# Altium schematic sheet WIFI & bluetooth.SchDoc
size A4; SheetNumber: 3; SheetTotal: 5
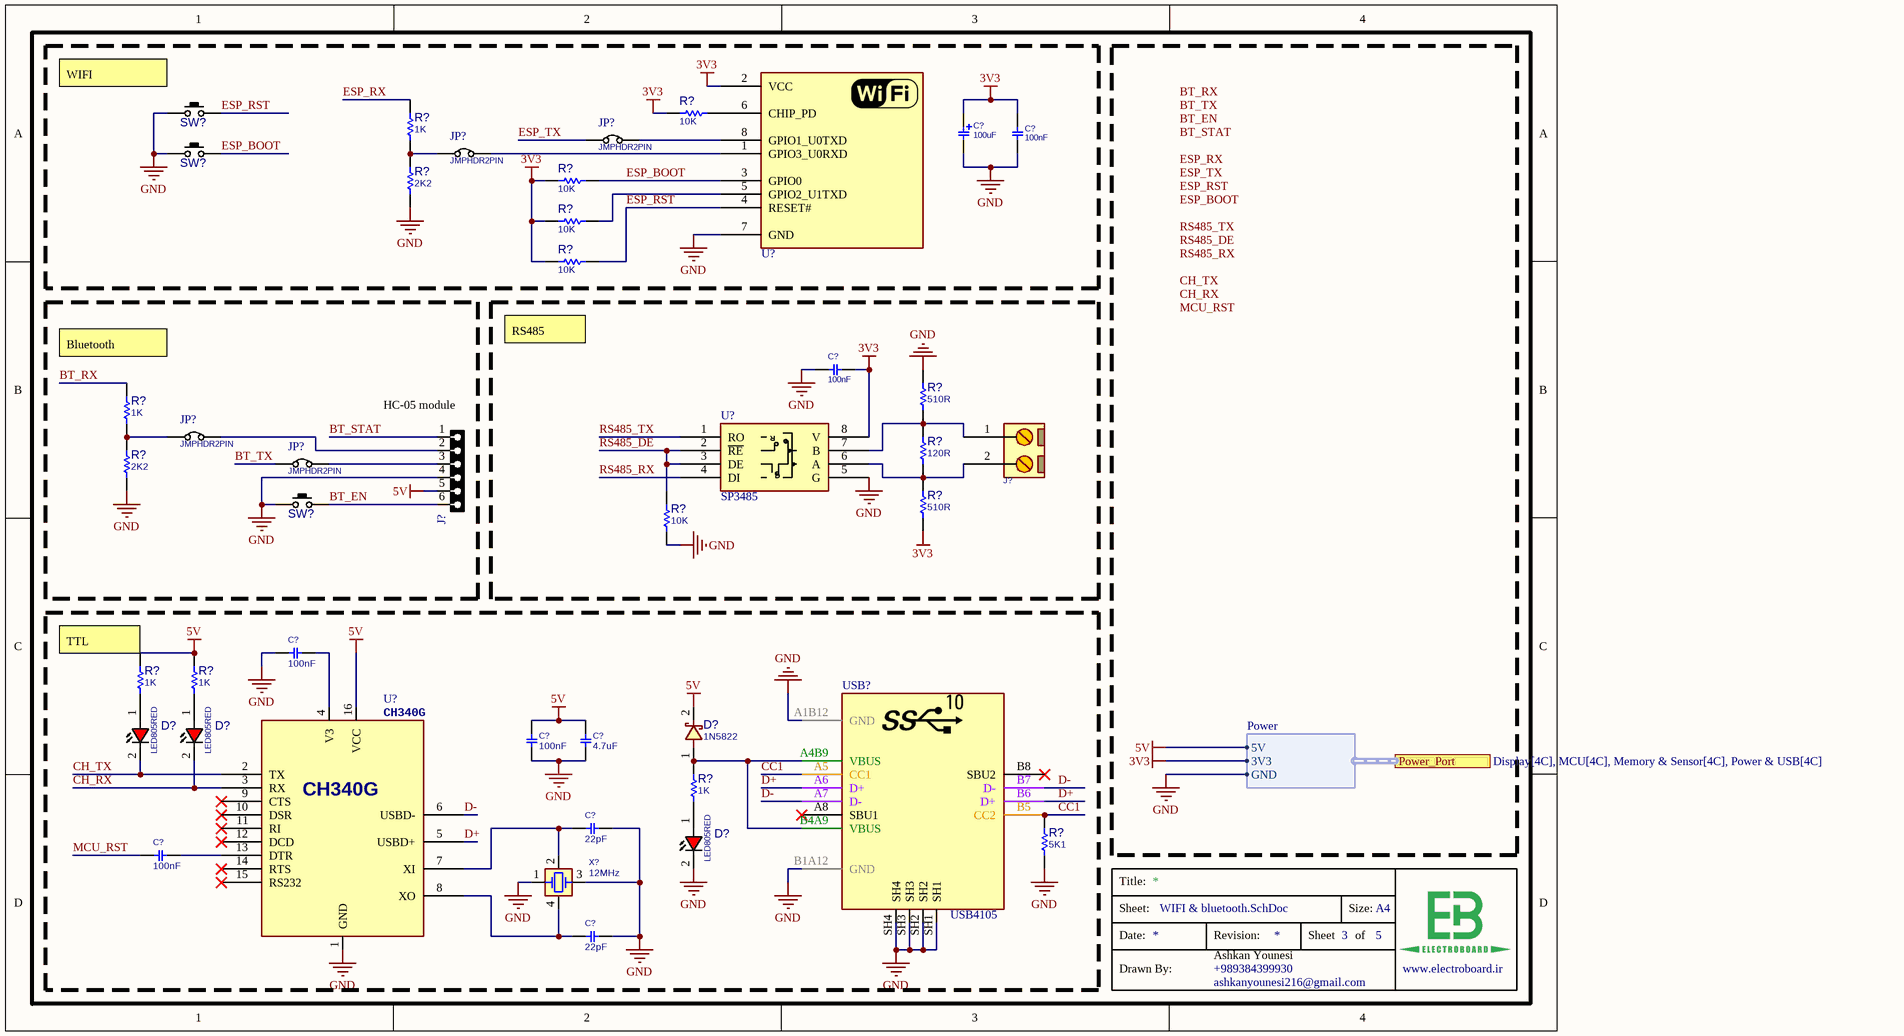
[diagram p0: WIFI & bluetooth.SchDoc]

## Parts
(Parts that share a designator on the sheet are numbered #1, #2 ... from top to bottom, then left to right.)
C?#1  100uF  [C_TN_3216]
C?#2  100nF  [C0603]
C?#3  100nF  [C0805]
C?#4  100nF  [C0805]
C?#5  100nF  [C0805]
C?#6  4.7uF  [C0805]
C?#7  22pF  [C0805]
C?#8  100nF  [C0805]
C?#9  22pF  [C0805]
D?#1  LED805RED  [LED0805RED]
D?#2  LED805RED  [LED0805RED]
D?#3  1N5822  [D_SMA]
D?#4  LED805RED  [LED0805RED]
J?#1  CONN_TB2  [MSTB_2]  (value not drawn)
J?#2  HDRF6  [HDR_F_1X6]  (value not drawn)
JP?#1  JMPHDR2PIN  [JP_2_BLK]
JP?#2  JMPHDR2PIN  [JP_2_BLK]
JP?#3  JMPHDR2PIN  [JP_2_BLK]
JP?#4  JMPHDR2PIN  [JP_2_BLK]
R?#1  10K  [R0805]
R?#2  1K  [R0805]
R?#3  2K2  [R0805]
R?#4  10K  [R0805]
R?#5  10K  [R0805]
R?#6  10K  [R0805]
R?#7  510R  [R0805]
R?#8  1K  [R0805]
R?#9  120R  [R0805]
R?#10  2K2  [R0805]
R?#11  510R  [R0805]
R?#12  10K  [R0805]
R?#13  1K  [R0805]
R?#14  1K  [R0805]
R?#15  1K  [R0805]
R?#16  5K1  [R0805]
SW?#1  PUSHBUTTON  [SWPBS_SPST_6X3X5]  (value not drawn)
SW?#2  PUSHBUTTON  [SWPBS_SPST_6X3X5]  (value not drawn)
SW?#3  PUSHBUTTON  [SWPBS_SPST_6X3X5]  (value not drawn)
U?#1  ESP-01  [ESP8266_ESP01]  (value not drawn)
U?#2  SP3485  [SO_8]
U?#3  CH340G  [SO_16]
USB?  USB4105  [USBC_SMD_16_USB4105]
X?  12MHz  [XTL_4_3225]

## Ports
Power_Port (harness POWER, see Display[4C], MCU[4C], Memory & Sensor[4C], Power & USB[4C])

## Harnesses
Power: 5V, 3V3, GND

## Nets
3V3: C?#1.1 C?#2.2 C?#3.1 R?#1.1 R?#4.1 R?#5.1 R?#6.1 R?#11.2 U?#1.2(VCC) U?#2.8(V) ; port Power_Port.3V3
5V: C?#5.2 C?#6.2 D?#3.2 J?#2.5 R?#13.1 R?#14.1 U?#3.16(VCC) ; port Power_Port.5V
GND: C?#1.2 C?#2.1 C?#3.2 C?#4.2 C?#5.1 C?#6.1 C?#7.1 C?#9.1 D?#4.2(CATHODE) J?#2.4 R?#3.2 R?#7.1 R?#10.2 R?#12.2 R?#16.2 SW?#1.1(P1) SW?#2.1(P1) SW?#3.1(P1) U?#1.7(GND) U?#2.5(G) U?#3.1(GND) USB?.A1B12(GND) USB?.B1A12(GND) USB?.SH1 USB?.SH2 USB?.SH3 USB?.SH4 X?.1 X?.3 ; port Power_Port.GND
BT_EN: J?#2.6 SW?#3.2(P3)
BT_RX: R?#8.1
BT_STAT: J?#2.1
BT_TX: JP?#4.1
CC1: R?#16.1 USB?.A5(CC1) USB?.B5(CC2)
CH_RX: D?#2.2(CATHODE) U?#3.3(RX)
CH_TX: D?#1.2(CATHODE) U?#3.2(TX)
D+: U?#3.5(USBD+) USB?.A6(D+) USB?.B6(D+)
D-: U?#3.6(USBD-) USB?.A7(D-) USB?.B7(D-)
ESP_BOOT: R?#4.2 SW?#2.2(P3) U?#1.3(GPIO0)
ESP_RST: R?#6.2 SW?#1.2(P3) U?#1.4(RESET#)
ESP_RX: R?#2.1
ESP_TX: JP?#1.1
MCU_RST: C?#8.2
RS485_DE: R?#12.1 U?#2.2(~{RE}) U?#2.3(DE)
RS485_RX: U?#2.4(DI)
RS485_TX: U?#2.1(RO)
NetC?#4_1: C?#4.1 U?#3.4(V3)
NetC?#7_2: C?#7.2 U?#3.7(XI) X?.2
NetC?#8_1: C?#8.1 U?#3.13(DTR)
NetC?#9_2: C?#9.2 U?#3.8(XO) X?.4
NetD?#1_1: D?#1.1(ANODE) R?#13.2
NetD?#2_1: D?#2.1(ANODE) R?#14.2
NetD?#3_1: D?#3.1 R?#15.1 USB?.A4B9(VBUS) USB?.B4A9(VBUS)
NetD?#4_1: D?#4.1(ANODE) R?#15.2
NetJ?#1_1: J?#1.1 R?#7.2 R?#9.1 U?#2.7(B)
NetJ?#1_2: J?#1.2 R?#9.2 R?#11.1 U?#2.6(A)
NetJ?#2_2: J?#2.2 JP?#3.2
NetJ?#2_3: J?#2.3 JP?#4.2
NetJP?#1_2: JP?#1.2 U?#1.8(GPIO1_U0TXD)
NetJP?#2_1: JP?#2.1 R?#2.2 R?#3.1
NetJP?#2_2: JP?#2.2 U?#1.1(GPIO3_U0RXD)
NetJP?#3_1: JP?#3.1 R?#8.2 R?#10.1
NetR?#1_2: R?#1.2 U?#1.6(CHIP_PD)
NetR?#5_2: R?#5.2 U?#1.5(GPIO2_U1TXD)

Not connected (* = marked no-connect by the designer): U?#3 9(CTS)* 10(DSR)* 11(RI)* 12(DCD)* 14(RTS)* 15(RS232)*; USB? A8(SBU1)* B8(SBU2)*

## Notes on the sheet
- (near SW?#1) WIFI
- (near R?#8) Bluetooth
- RS485
- (near J?#2) HC-05 module
- (near R?#13) TTL
- Labels drawn without touching a wire or pin: BT_EN, BT_RX, BT_STAT, BT_TX, CH_RX, CH_TX, ESP_BOOT, ESP_RST, ESP_RX, ESP_TX, MCU_RST, RS485_DE, RS485_RX, RS485_TX
- Title:
- Sheet:
- Size:
- A4
- Drawn By:
- Date:
- Revision:
- Ashkan Younesi
- ashkanyounesi216@gmail.com
- +989384399930
- Sheet
- of
- www.electroboard.ir <http://www.electroboard.ir>
- (in symbol SP3485_SOP8) R; D

## Library data of the parts
C?#1 = CAP_SMD_TAN_10uF_10V: CAP, SMD, TAN; PARAM: 20%, 300mOhm, -55~105oC; MANF: VISHAY; MANF_P#: T55A106M010C0300; PARAM2: 10V; PRICE: 0.46$; VALUE: 100uF
C?#2 = CAP_SMD_MLCC: CAP, MLCC, 1nF, 50V, C0G, 10%, 0402; DESC: CAP, MLCC, 100nF, 50V, C0G, 10%, 0402; MANF_P#: MANF_PART#; MANF: Murata; PARAM: C0G, 10%; PRICE: 100= 1$; PARAM2: 50V; ASSEMBLY: ASSEMBLY; VALUE: 100nF
C?#3 = CAP_SMD_MLCC_0805: CAP, MLCC, -F, -V, MATERIAL, -%, 0201; PARAM: -, -%; MANF_P#: MANF_PART#; PRICE: 100= 1$; MANF: -; PARAM2: -V; ASSEMBLY: ASSEMBLY; VALUE: 100nF
C?#4-C?#9 = CAP_SMD_MLCC: CAP, MLCC; PARAM: C0G, 10%; DESC: CAP, MLCC, 1nF, 50V, C0G, 10%, 0402; MANF_P#: MANF_PART#; MANF: Murata; PARAM2: 50V; PRICE: 100= 1$; ASSEMBLY: ASSEMBLY
  C?#4 C?#5 C?#8: VALUE: 100nF
  C?#6: VALUE: 4.7uF
  C?#7 C?#9: VALUE: 22pF
D?#1 D?#2 D?#4 = LED_SMD_0805_RED: LED, SMD, 0805, RED; DESC: DESCRIPTION; MANF_P#: MANF_PART#; PARAM2: 2.2V; MANF: MANF; ASSEMBLY: ASSEMBLY; PRICE: 36t@Javan; VALUE: LED805RED
D?#3 = DIODE_SMD_SCHOTTKY_1N5822: DIODE, SCHOTTKY, 40V, 3A; MANF: DIODES; DESC: DESCRIPTION; MANF_P#: 1N5822; ASSEMBLY: ASSEMBLY; PRICE: PRICE; PARAM2: 3A; PARAM: 40V; VALUE: 1N5822
J?#1 = CONN_MSTB_2: CONN, PHOENIX MSTB, 5-G, 5.08mm pitch; PARAM2: 320V; PARAM: 12A; VALUE: CONN_TB2
J?#2 = HDR_F_1X6: CONN, HEADER, Female, pitch: 2.54mm, 6POS; VALUE: HDRF6
JP?#1-JP?#4 = JUMPER_HDR_2P: JUMPER, HEADER 2PIN; MANF: MANF; MANF_P#: MANF_P#; VALUE: JMPHDR2PIN
R?#1-R?#6 R?#8 R?#10 R?#13-R?#16 = RES_SMD_0805: RESISTOR, SMD; PARAM: -W; DESC: DESCRIPTION; DIST#: MOUSER; PARAM2: 1%; MANF_P#: -; MANF: -; ASSEMBLY: ASSEMBLY; PRICE: 100= 0.5$
  R?#1 R?#4-R?#6: VALUE: 10K
  R?#2 R?#8 R?#13-R?#15: VALUE: 1K
  R?#3 R?#10: VALUE: 2K2
  R?#16: VALUE: 5K1
R?#7 R?#9 R?#11 R?#12 = RES_SMD: RESISTOR, SMD; PARAM: -W; DESC: DESCRIPTION; DIST#: MOUSER; PARAM2: 1%; MANF_P#: -; MANF: -; ASSEMBLY: ASSEMBLY; PRICE: 100= 0.5$
  R?#7 R?#11: VALUE: 510R
  R?#9: VALUE: 120R
  R?#12: VALUE: 10K
SW?#1-SW?#3 = SWPBS_SPST_6X3X5: SWITCH, PUSH BUTTON, TACTILE, SMD, SPST, 6X3.5X5mm; MANF: ALPS; DESC: DESCRIPTION; MANF_P#: SKQMBBE010; VALUE: PUSHBUTTON; ASSEMBLY: ASSEMBLY; PARAM: PARAM; PRICE: PRICE
U?#1 = ESP8266_ESP-01: ESP8266 ESP-01 WiFi Module; MANF_P#: ESP-01; VALUE: ESP-01
U?#2 = SP3485_SOP8: RS-485 Transceiver, 3.3V; MANF: Exar; MANF_P#: SP3485; PRICE: 2.5$@MOUSER; VALUE: SP3485
U?#3 = CH340G_SOP16: USB-UART; MANF_P#: CH340G; VALUE: CH340G
USB? = CONN_USBC_SMD_16_USB4105: CONN, USB, Type C, USB 2.0, Right-Angle, SMD; MANF: GCT; MANF_P#: USB4105-GF-A; PARAM: 5A; Price: 1.5$; Value: USB4105
X? = XTL_4_12MHz_3225: Crystal 12MHz; MANF: ECS; MANF_P#: ECS-120-18-33-JEM-TR; PARAM: 20PPM, 18pF; PRICE: 0.5$; VALUE: 12MHz